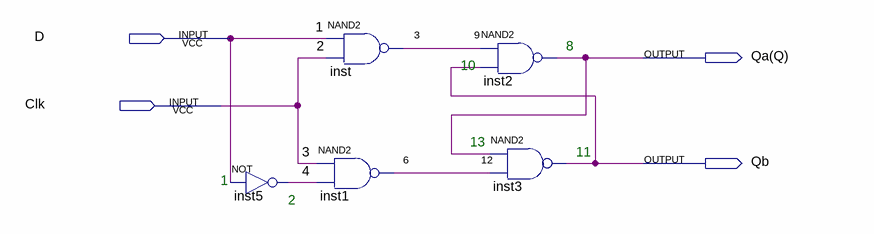
[diagram p0: schematic sheet]
// Quartus schematic Gated_D_Latch_Diagram.bdf as structural Verilog: 5 symbols, 4 pins
module Gated_D_Latch_Diagram (
  input  D,
  input  Clk,
  output \Qa(Q) ,
  output Qb
);

  wire \3__________________9 , \4 , \6________________________12 ;

  not inst5 (\4 , D);
  nand inst (\3__________________9 , D, Clk);
  nand inst1 (\6________________________12 , Clk, \4 );
  nand inst2 (\Qa(Q) , \3__________________9 , Qb);
  nand inst3 (Qb, \Qa(Q) , \6________________________12 );

  // Other names for the same wires on the sheet: 2 = Clk; 3 = Clk; 1 = D

  // Notes on the sheet:
  //   8
  //   10
  //   13
  //   11
  //   1
  //   2
endmodule
